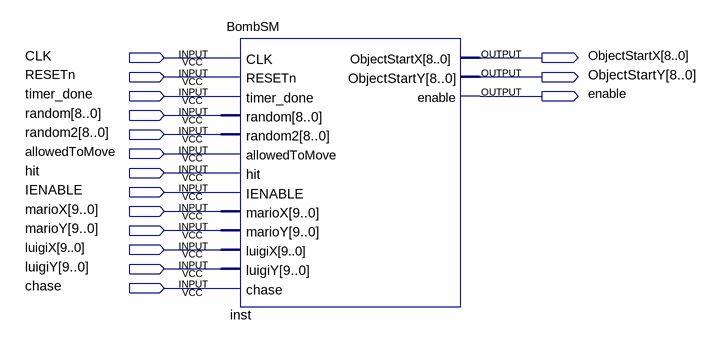
[diagram p0: schematic sheet]
// Quartus schematic bomb_sm_for_sim.bdf as structural Verilog: 1 symbols, 16 pins
module bomb_sm_for_sim (
  input  CLK,
  input  RESETn,
  input  timer_done,
  input  [8:0] random,
  input  [8:0] random2,
  input  allowedToMove,
  input  hit,
  input  IENABLE,
  input  [9:0] marioX,
  input  [9:0] marioY,
  input  [9:0] luigiX,
  input  [9:0] luigiY,
  input  chase,
  output [8:0] ObjectStartX,
  output [8:0] ObjectStartY,
  output enable
);

  BombSM inst (
    .CLK(CLK), .RESETn(RESETn), .timer_done(timer_done), .random(random), .random2(random2),
    .allowedToMove(allowedToMove), .hit(hit), .IENABLE(IENABLE), .marioX(marioX), .marioY(marioY),
    .luigiX(luigiX), .luigiY(luigiY), .chase(chase), .ObjectStartX(ObjectStartX),
    .ObjectStartY(ObjectStartY), .enable(enable));
endmodule
